# Altium schematic sheet FRONT_MCU.SchDoc: SDR200
size 420 x 297 mm; DocumentNumber: XXXX.468179.001 Э3; SheetNumber: 6; SheetTotal: 7; Title2str: Передняя панель; DocumentType: Схема электрическая принципиальная; Scale: 1:1
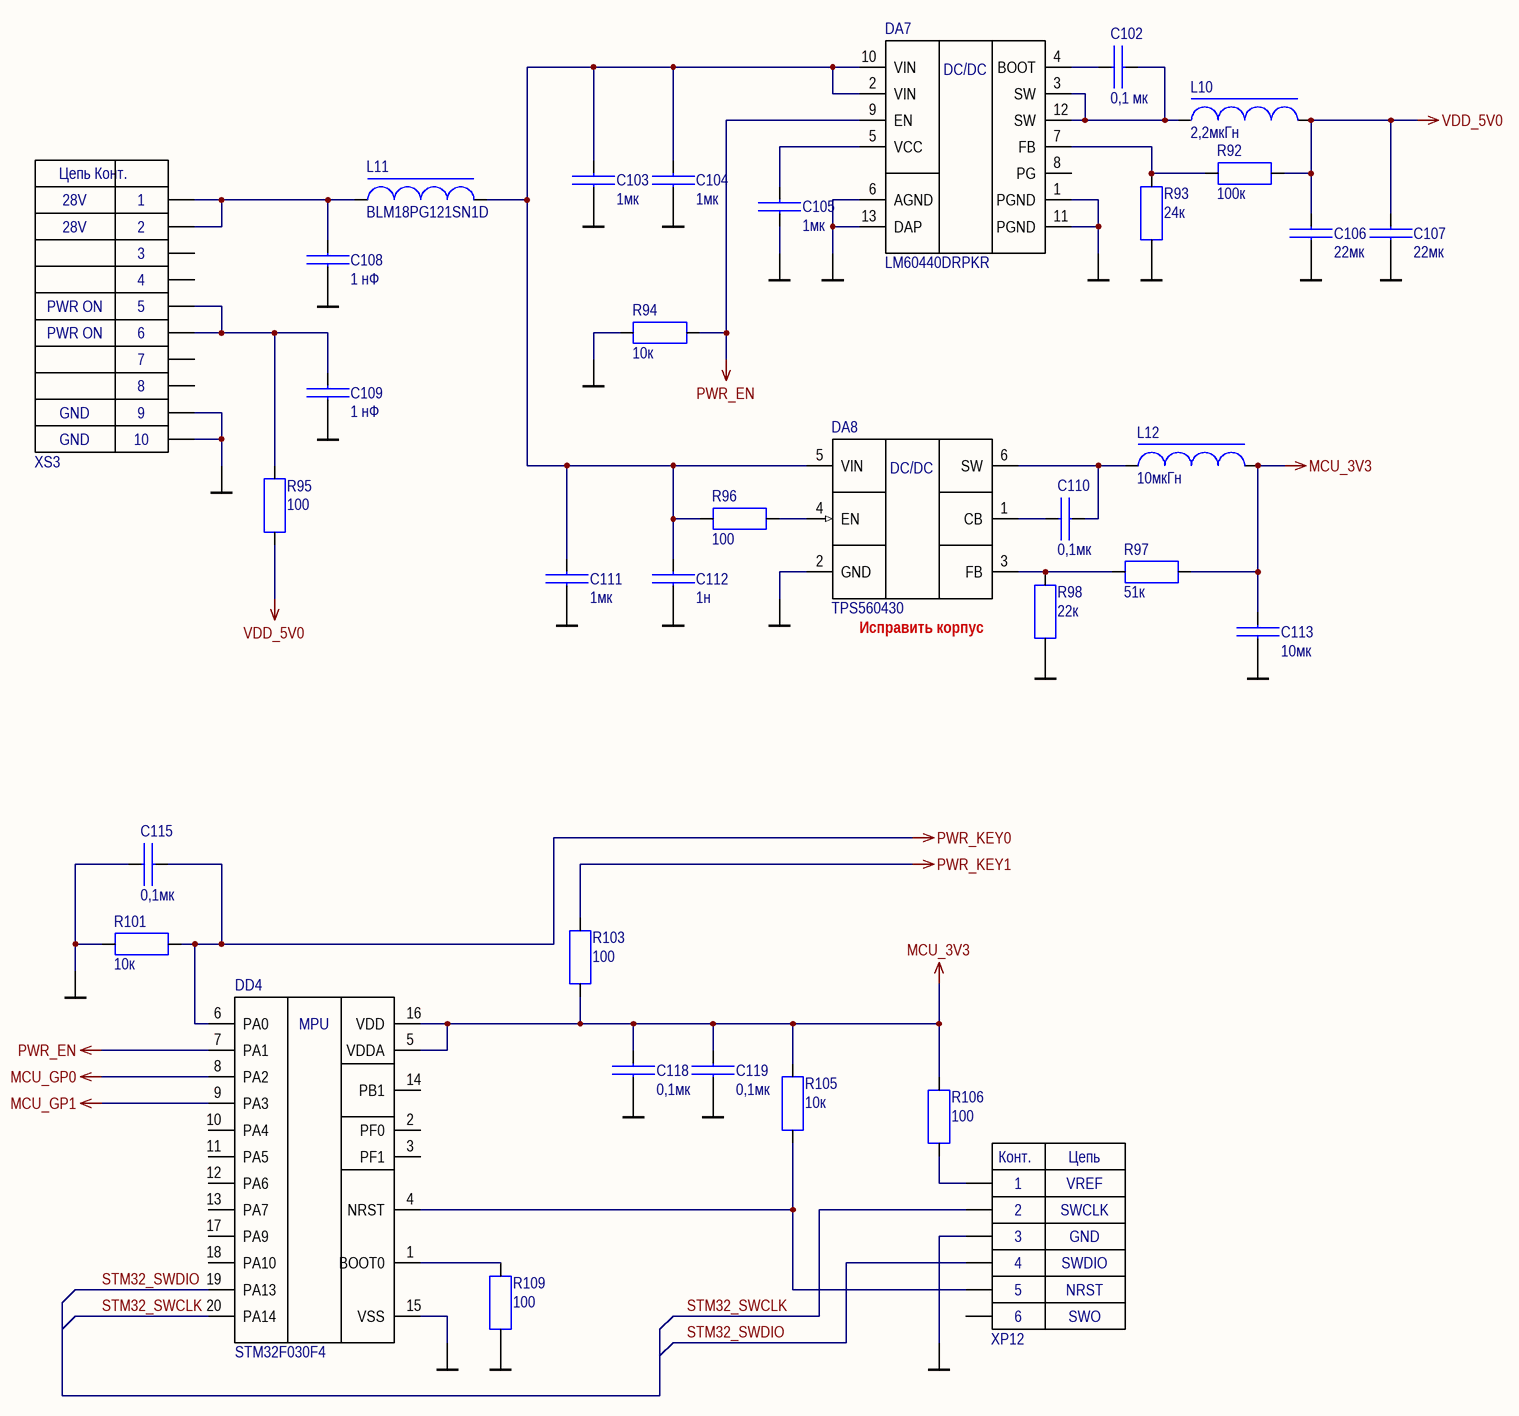
[diagram p0: FRONT_MCU.SchDoc]

## Parts
C102  Nominal: 0,1 мк  [CAPC1005X05L]  (hidden comment: CC0402KRX5R6BB104)
C103  Nominal: 1мк  [CAPC2012X09L]  (hidden comment: CC0805KKX7R9BB105)
C104  Nominal: 1мк  [CAPC2012X09L]  (hidden comment: CC0805KKX7R9BB105)
C105  Nominal: 1мк  [CAPC1005X05L]  (hidden comment: CC0402KRX5R5BB105)
C106  Nominal: 22мк  [CAPC2012X09L]  (hidden comment: CC0805MKX5R5BB226)
C107  Nominal: 22мк  [CAPC2012X09L]  (hidden comment: CC0805MKX5R5BB226)
C108  Nominal: 1 нФ  [CAPC1005X05L]
C109  Nominal: 1 нФ  [CAPC1005X05L]
C110  Nominal: 0,1мк  [CAPC1608X08L]  (hidden comment: CC0603KRX7R9BB103)
C111  Nominal: 1мк  [CAPC2012X09L]  (hidden comment: CC0805KKX7R9BB105)
C112  Nominal: 1н  [CAPC1005X05L]  (hidden comment: C0402C102J5GACTU)
C113  Nominal: 10мк  [CAPC2012X09L]  (hidden comment: CC0805KKX5R8BB106)
C115  Nominal: 0,1мк  [CAPC1005X05L]  (hidden comment: CC0402KRX5R6BB104)
C118  Nominal: 0,1мк  [CAPC1005X05L]  (hidden comment: CC0402KRX5R6BB104)
C119  Nominal: 0,1мк  [CAPC1005X05L]  (hidden comment: CC0402KRX5R6BB104)
DA7  LM60440DRPKR  [WQFN-13]
DA8  TPS560430  [TSOP65P280X110-8L]
DD4  STM32F030F4  [TSOP65P640X120-20L]
L10  Nominal: 2,2мкГн  [INDCXGL4020]  (hidden comment: XGL4020-222ME)
L11  BLM18PG121SN1D  [INDC1608X05L]
L12  Nominal: 10мкГн  [INDC1812PS]  (hidden comment: 1812PS-103KR)
R92  Nominal: 100к  [RESC1005X04L]  (hidden comment: RC0402JR-07100KL)
R93  Nominal: 24к  [RESC1005X04L]  (hidden comment: RC0402JR-0724KL)
R94  Nominal: 10к  [RESC1005X04L]  (hidden comment: RC0402JR-0710KL)
R95  Nominal: 100  [RESC1005X04L]  (hidden comment: RC0402JR-07100RL)
R96  Nominal: 100  [RESC1005X04L]  (hidden comment: RC0402JR-07100RL)
R97  Nominal: 51к  [RESC1005X04L]  (hidden comment: RC0402JR-0751KL)
R98  Nominal: 22к  [RESC1005X04L]  (hidden comment: RC0402JR-0722KL)
R101  Nominal: 10к  [RESC1005X04L]  (hidden comment: RC0402JR-0710KL)
R103  Nominal: 100  [RESC1005X04L]  (hidden comment: RC0402JR-07100RL)
R105  Nominal: 10к  [RESC1005X04L]  (hidden comment: RC0402JR-0710KL)
R106  Nominal: 100  [RESC1005X04L]  (hidden comment: RC0402JR-07100RL)
R109  Nominal: 100  [RESC1005X04L]  (hidden comment: RC0402JR-07100RL)
XP12  PLS-6  [HDR1X6]  (value not drawn)
XS3  FH12-10S-0.5SVA  [FH12-10S-0.5SH]  (value not drawn)

## Nets
GND: C103.1 C104.1 C105.1 C106.1 C107.1 C108.1 C109.1 C111.2 C112.2 C113.1 C115.1 C118.2 C119.2 DA7.1(PGND) DA7.6(AGND) DA7.11(PGND) DA7.13(DAP) DA8.2(GND) DD4.15(VSS) R93.2 R94.2 R98.1 R101.2 R109.1 XP12.3 XS3.9 XS3.10
MCU_3V3: C113.2 C118.1 C119.1 DD4.5(VDDA) DD4.16(VDD) L12.1 R97.1 R103.1 R105.2 R106.2
MCU_GP0: DD4.8(PA2)
MCU_GP1: DD4.9(PA3)
PWR_EN: DA7.9(EN) DD4.7(PA1) R94.1
PWR_KEY0: C115.2 DD4.6(PA0) R101.1
PWR_KEY1: R103.2
VDD_5V0: C106.2 C107.2 L10.1 R92.1 R95.1
STM32_SWCLK: DD4.20(PA14) XP12.2
STM32_SWDIO: DD4.19(PA13) XP12.4
NetC102_1: C102.1 DA7.4(BOOT)
NetC102_2: C102.2 DA7.3(SW) DA7.12(SW) L10.2
NetC103_2: C103.2 C104.2 C111.1 C112.1 DA7.2(VIN) DA7.10(VIN) DA8.5(VIN) L11.1 R96.1
NetC105_2: C105.2 DA7.5(VCC)
NetC108_2: C108.2 L11.2 XS3.1 XS3.2
NetC109_2: C109.2 R95.2 XS3.5 XS3.6
NetC110_1: C110.1 DA8.1(CB)
NetC110_2: C110.2 DA8.6(SW) L12.2
NetDA7_7: DA7.7(FB) R92.2 R93.1
NetDA8_3: DA8.3(FB) R97.2 R98.2
NetDA8_4: DA8.4(EN) R96.2
NetDD4_1: DD4.1(BOOT0) R109.2
NetDD4_4: DD4.4(NRST) R105.1 XP12.5
NetR106_1: R106.1 XP12.1

Not connected (* = marked no-connect by the designer): DA7 8(PG); DD4 2(PF0) 3(PF1) 10(PA4) 11(PA5) 12(PA6) 13(PA7) 14(PB1) 17(PA9) 18(PA10); XP12 6; XS3 3 4 7 8

## Notes on the sheet
- 28V
- PWR ON
- GND
- Исправить корпус
- Подп. и дата
- Инв. № дубл.
- Взам. инв. №
- Инв. № подл.
- Изм.
- Лист
- № докум.
- Подп.
- Дата
- 2.106-A3
- Копировал
- Формат А3
- (in symbol FH12-10S-0.5SVA) Цепь; Конт.
- (in symbol LM60440DRPKR) DC/DC
- (in symbol STM32 S-LINK PLS-6) Конт.; Цепь; VREF; SWCLK; GND; SWDIO; NRST; SWO
- (in symbol STM32F030F4) MPU
- (in symbol TPS560430) DC/DC

## Library data of the parts
C102 C115 C118 C119 = CC0402KRX5R6BB104: ЧИП конденсатор; Manufacturer: Yageo; ID: 0402 0,1 мкФ 10В X7R; Tolerance: 10%; Type: X7R; Value: 0402 0,1 мкФ 10В X7R; RuNominal: 0,1 мкФ; Voltage: 10В; ManufacturerPartNumber: CC0402KRX5R6BB104; Rem: *
C103 C104 C111 = CC0805KKX7R9BB105: ЧИП конденсатор; Manufacturer: Yageo; ID: 0805 1 мкФ 50В X7R; Tolerance: 0,1; Type: X7R; Value: 0805 1 мкФ 50В X7R; RuNominal: 1 мкФ; Voltage: 50В; ManufacturerPartNumber: CC0805KKX7R9BB105; Rem: *
C105 = CC0402KRX5R5BB105: ЧИП конденсатор; Manufacturer: Yageo; ID: 0402 1 мкФ 6,3В X5R; Tolerance: 10%; Type: X5R; Value: 0402 1 мкФ 6,3В X5R; RuNominal: 1 мкФ; Voltage: 6,3В; ManufacturerPartNumber: CC0402KRX5R5BB105; Rem: *
C106 C107 = CC0805MKX5R5BB226: ЧИП конденсатор; Manufacturer: Yageo; ID: 0805 22 мкФ 6,3В X5R; Tolerance: 0,2; Type: X5R; Value: 0805 22 мкФ 6,3В X5R; RuNominal: 22 мкФ; Voltage: 6,3В; ManufacturerPartNumber: CC0805MKX5R5BB226; Rem: *
C108 C109 = C0402C102J5GACTU: ЧИП конденсатор; Manufacturer: Yageo; ID: 0402 1 нФ 50В C0G; Tolerance: 5%; Type: C0G; Value: 0402 1 нФ 50В C0G; Voltage: 50В; ManufacturerPartNumber: C0402C102J5GACTU; Rem: *; RuNominal: 1 нФ
C110 = CC0603KRX7R9BB103: ЧИП конденсатор; Manufacturer: Yageo; ID: 0603 0,1 мкФ 50В X7R; Tolerance: 10%; Type: X7R; Value: 0603 0,1 мкФ 50В X7R; RuNominal: 0,1 мкФ; Voltage: 50В; ManufacturerPartNumber: CC0603KRX7R9BB103; Rem: *
C112 = C0402C102J5GACTU: ЧИП конденсатор; Manufacturer: Yageo; ID: 0402 1 нФ 50В C0G; Tolerance: 5%; Type: C0G; Value: 0402 1 нФ 50В C0G; RuNominal: 1 нФ; Voltage: 50В; ManufacturerPartNumber: C0402C102J5GACTU; Rem: *
C113 = CC0805KKX5R8BB106: ЧИП конденсатор; Manufacturer: Yageo; ID: 0805 10 мкФ 25В X7R; Tolerance: 0,1; Type: X7R; Value: 0805 10 мкФ 25В X7R; RuNominal: 10 мкФ; Voltage: 25В; ManufacturerPartNumber: CC0805KKX5R8BB106; Rem: *
DA7 = LM60440DRPKR: 3.8-V to 36-V, 4-A Ultra-Small Synchronous Step-Down Converter; Manufacturer: TI; Value: LM60440DRPKR; ComponentLink1Description: datasheet; ComponentLink1URL: https://www.ti.com/lit/ds/symlink/lm60440.pdf?HQS=dis-dk-null-digikeymode-dsf-pf-null-wwe&ts=1663282176250&ref_url=https%253A%252F%252Fwww.digikey.si%252F; ManufacturerPartNumber: LM60440DRPKR; Rem: *
DA8 = TPS560430: SIMPLE SWITCHER® 4-V to 36-V, 600-mA Synchronous Step-Down Converter; Manufacturer: TI; Value: TPS560430; ComponentLink1Description: datasheet; ComponentLink1URL: https://www.ti.com/lit/ds/symlink/tps560430.pdf?ts=1769393151340; ManufacturerPartNumber: TPS560430; Rem: *
DD4 = STM32F030F4: Value-line Arm®-based 32-bit MCU with16 KB Flash, timers, ADC, communication interfaces, 2.4-3.6 V operation; Manufacturer: STM; ComponentLink1Description: datasheet; ComponentLink1URL: http://www.analog.com/media/en/technical-documentation/data-sheets/ADCLK944.pdf; ManufacturerPartNumber: STM32F030F4; Rem: *; Value: STM32F030F4
L10 = XGL4020-222ME: Shielded Power Inductors; Manufacturer: Coilcraft; ID: XGL4020 2,2мкГн; Value: XGL4020 2,2мкГн; Current: 2,7А; DC Res: 19,5mOhms; ManufacturerPartNumber: XGL4020-222ME
L11 = BLM18PG121SN1D: Chip Ferrite Beads (0603 Size); Manufacturer: Murata; Rem: 120ohm ±25%; Current: 2000mA; DC Res: 0.05ohm; Nominal: BLM18PG121SN1D; ID: BLM18PG121SN1D; ManufacturerPartNumber: BLM18PG121SN1D; Value: BLM18PG121SN1D
L12 = 1812PS-103KR: Shielded High SRF Inductors; Manufacturer: Coilcraft; ID: 1812PS 10мкГн 10%; Rem: 10%; Value: 1812PS 10мкГн 10%; Current: 0,9А; DC Res: 0.17; ManufacturerPartNumber: 1812PS-103KR
R92 = RC0402JR-07100KL: ЧИП резистор; Manufacturer: Yageo; ID: 0402 100 кОм 5%; Tolerance: 5%; Value: 0402 100 кОм 5%; ManufacturerPartNumber: RC0402JR-07100KL; Rem: *; Type: *
R93 = RC0402JR-0724KL: ЧИП резистор; Manufacturer: Yageo; ID: 0402 24 кОм 5%; Tolerance: 5%; Value: 0402 24 кОм 5%; ManufacturerPartNumber: RC0402JR-0724KL; Rem: *; Type: *
R94 R101 R105 = RC0402JR-0710KL: ЧИП резистор; Manufacturer: Yageo; ID: 0402 10 кОм 5%; Tolerance: 5%; Value: 0402 10 кОм 5%; ManufacturerPartNumber: RC0402JR-0710KL; Rem: *; Type: *
R95 R96 R103 R106 R109 = RC0402JR-07100RL: ЧИП резистор; Manufacturer: Yageo; ID: 0402 100 Ом 5%; Tolerance: 5%; Value: 0402 100 Ом 5%; ManufacturerPartNumber: RC0402JR-07100RL; Rem: *; Type: *
R97 = RC0402JR-0751KL: ЧИП резистор; Manufacturer: Yageo; ID: 0402 51 кОм 5%; Tolerance: 5%; Value: 0402 51 кОм 5%; ManufacturerPartNumber: RC0402JR-0751KL; Rem: *; Type: *
R98 = RC0402JR-0722KL: ЧИП резистор; Manufacturer: Yageo; ID: 0402 22 кОм 5%; Tolerance: 5%; Value: 0402 22 кОм 5%; ManufacturerPartNumber: RC0402JR-0722KL; Rem: *; Type: *
XP12 = STM32 S-LINK PLS-6
XS3 = FH12-10S-0.5SVA: Manufacturer: Hirose; ManufacturerPartNumber: FH12-10S-0.5SVA